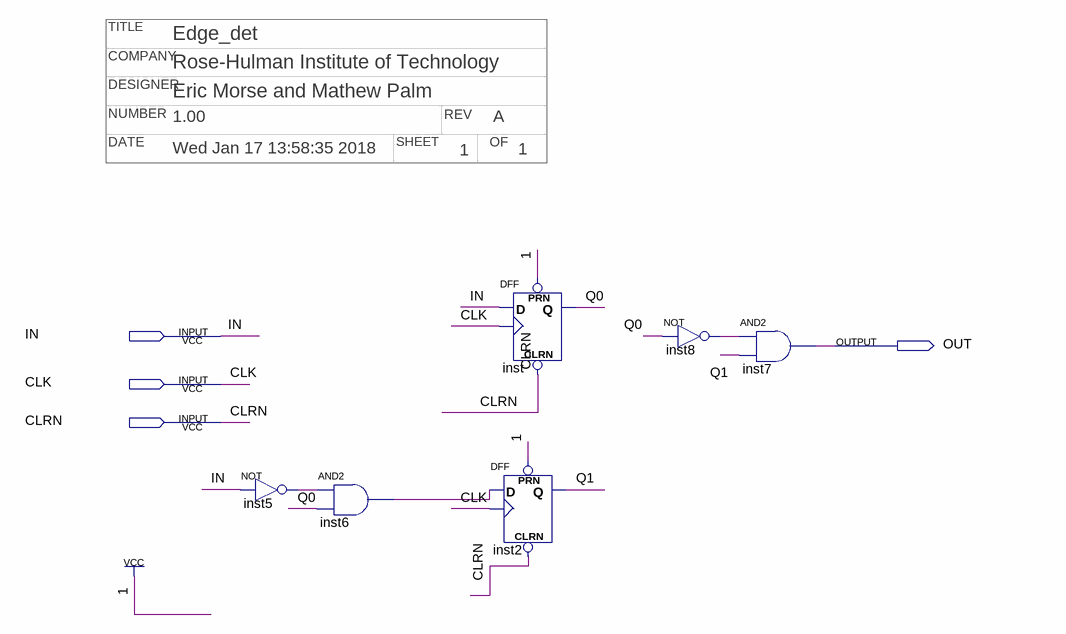
[diagram p0: schematic sheet]
// Quartus schematic edge_det.bdf as structural Verilog: 6 symbols, 4 pins
// Title block: COMPANY: Rose-Hulman Institute of Technology; DATE: Wed Jan 17 13:58:35 2018; DESIGNER: Eric Morse and Mathew Palm; NUMBER: 1.00; OF: 1; REV: A; SHEET: 1; TITLE: Edge_det
module edge_det (
  input  IN,
  input  CLK,
  input  CLRN,
  output OUT
);

  wire inst5_out, inst6_out, inst8_out, Q0, Q1;

  not inst5 (inst5_out, IN);
  and inst6 (inst6_out, inst5_out, Q0);
  DFF inst (.CLRN(CLRN), .CLK(CLK), .D(IN), .PRN(1'b1), .Q(Q0));
  DFF inst2 (.CLRN(CLRN), .CLK(CLK), .D(inst6_out), .PRN(1'b1), .Q(Q1));
  not inst8 (inst8_out, Q0);
  and inst7 (OUT, inst8_out, Q1);
endmodule
